# EAGLE design fisk-batt-6 (EAGLE 7.6.0)
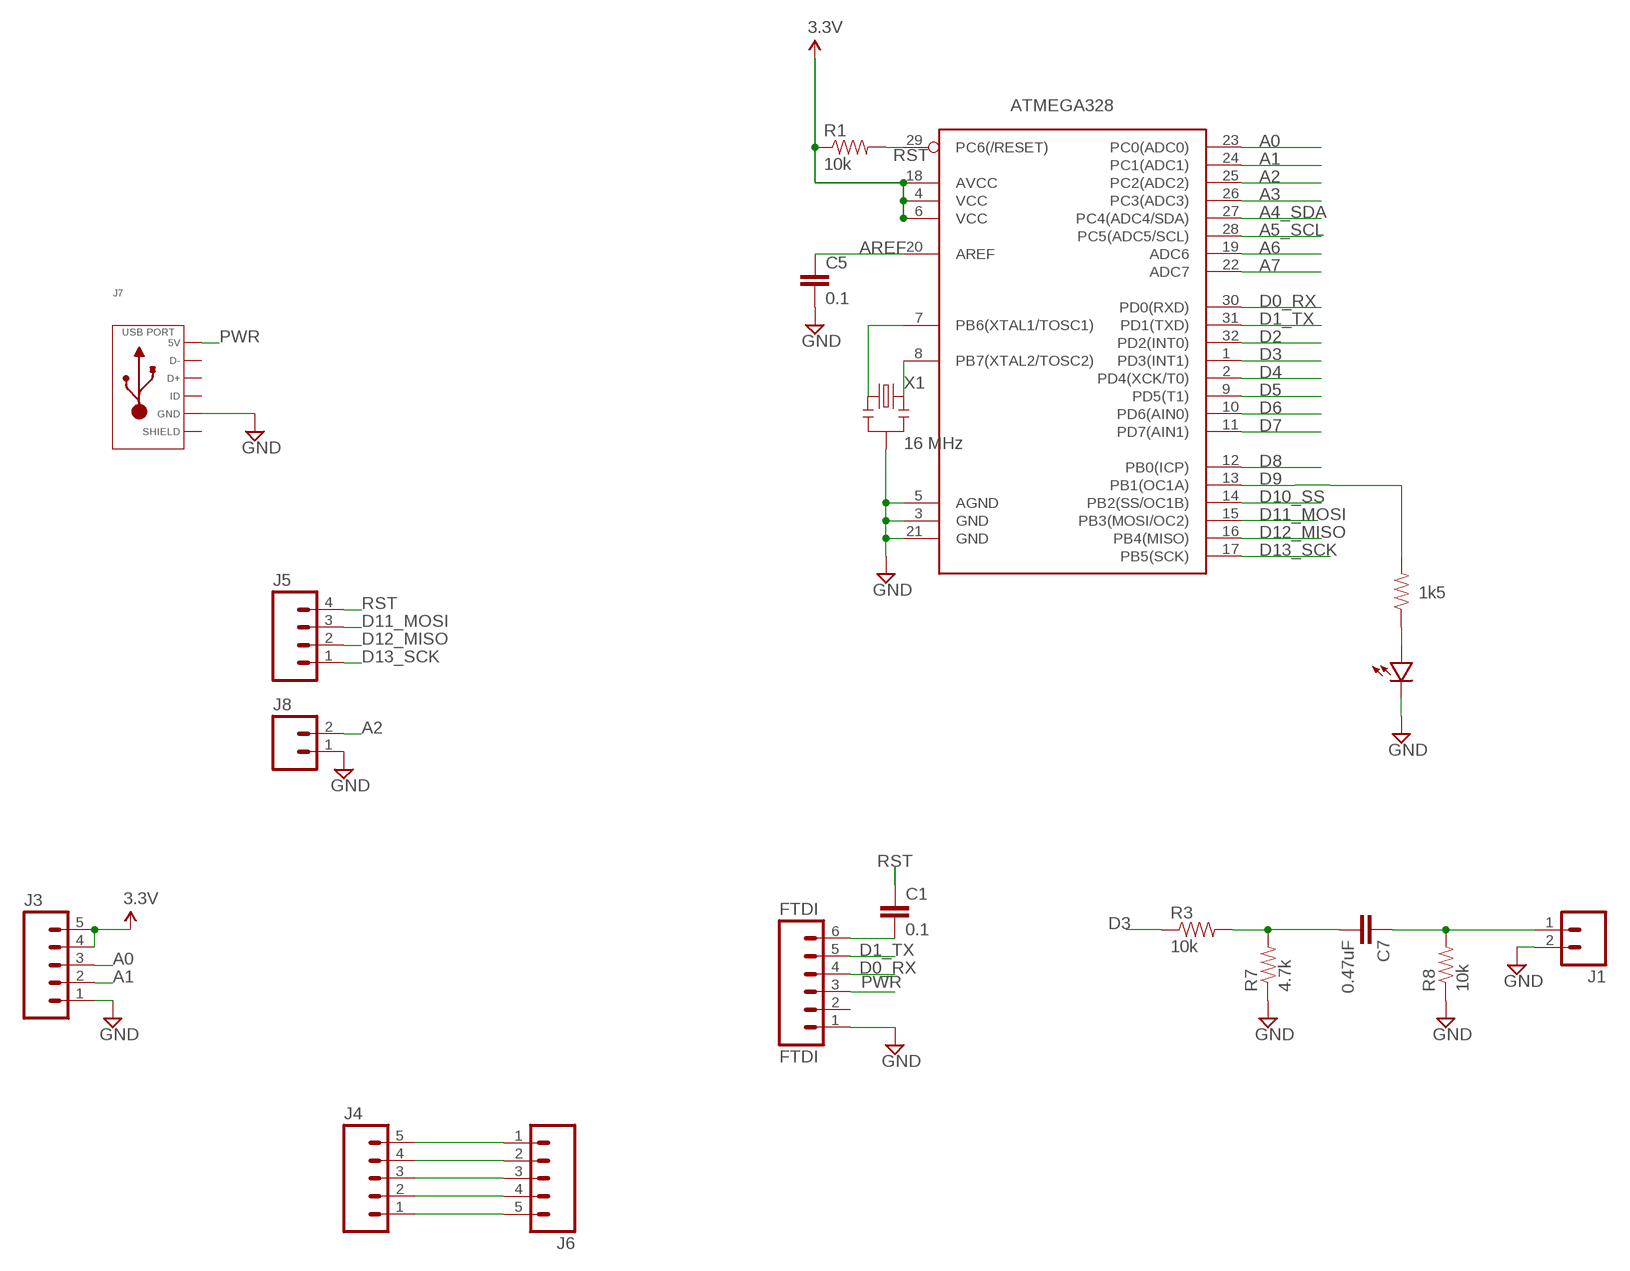
[diagram p0: schematic, sheet 1, part 1 of 2]
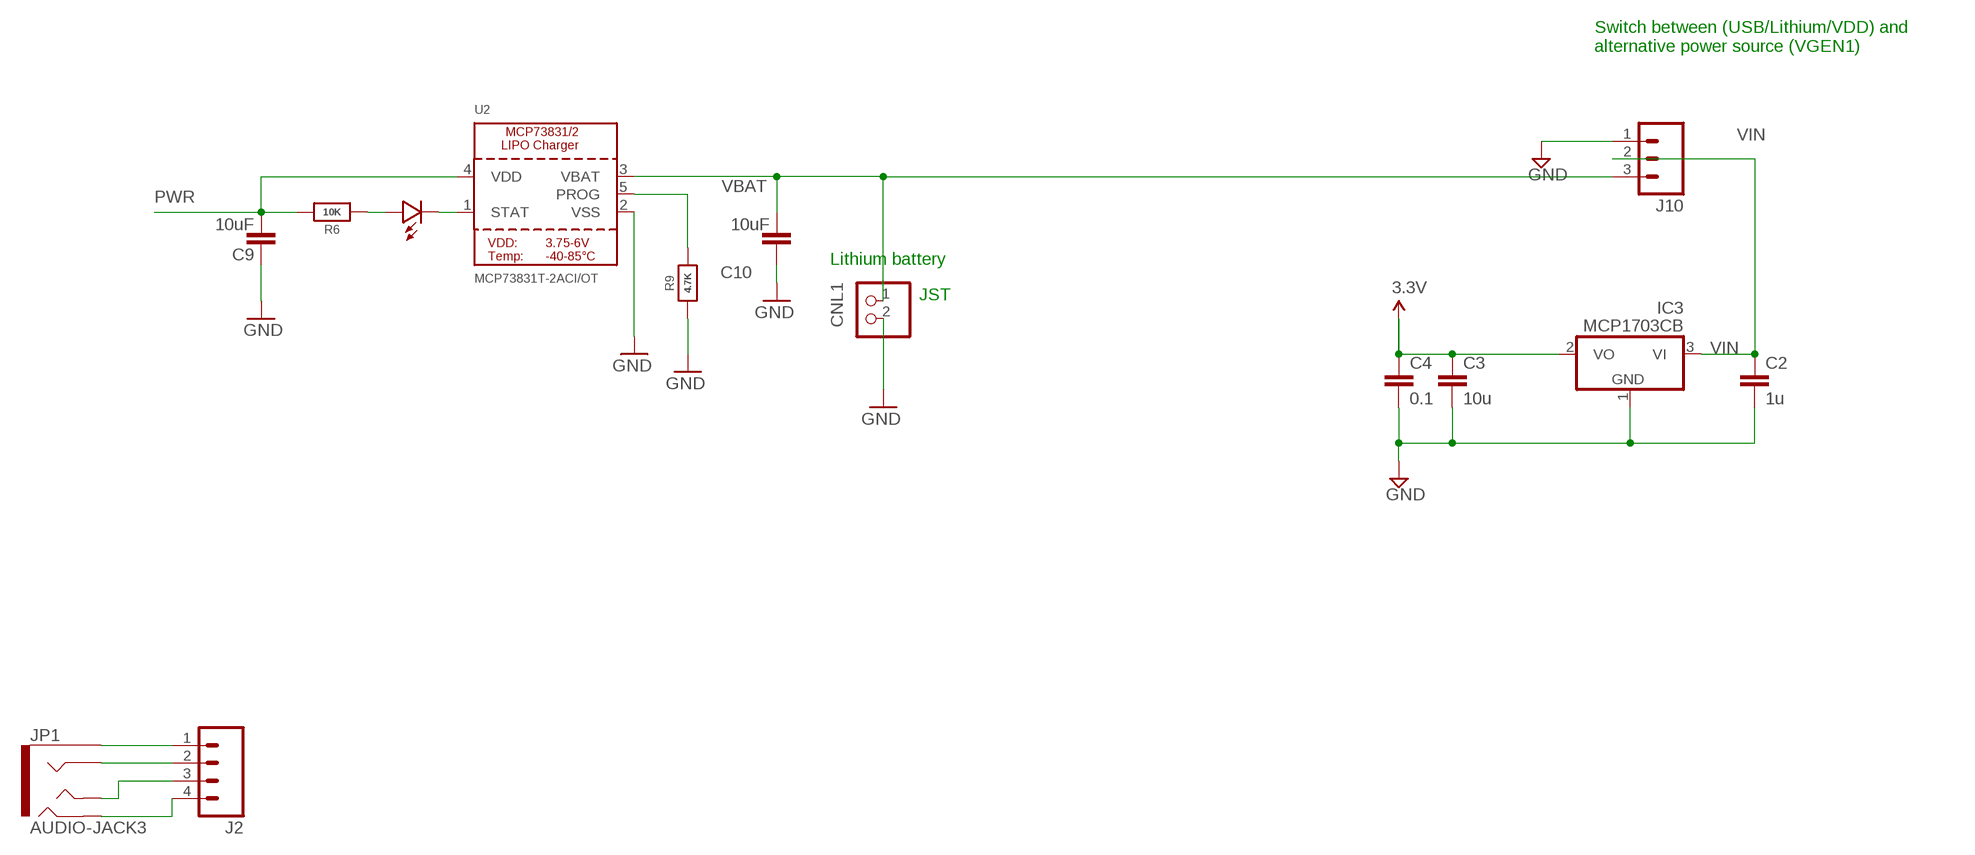
[diagram p1: schematic, sheet 1, part 2 of 2]

## Parts
ATMEGA328  ATMega-328  ATMEGA168/328TQFP32  [TQFP32-08]
C1  0.1  CAP0603-CAP  [0603-CAP]
C2  1u  CAP0603-CAP  [0603-CAP]
C3  10u  CAP0805-CAP  [0805-CAP]
C4  0.1  CAP0603-CAP  [0603-CAP]
C5  0.1  CAP0603-CAP  [0603-CAP]
C7  0.47uF  CAP0603-CAP  [0603-CAP]
C9  10uF  CAP0603-CAP  [0603-CAP]
C10  10uF  CAP0603-CAP  [0603-CAP]
CNL1  JST_2PIN-SMT-RA  [JST-PH-2-SMT-RA]
D2  LED0603  [0603-LED]
FTDI  FTDI  M06SIP  [1X06]
IC3  MCP1703CB  [SOT23]
J1  M02PTH  [1X02]
J2  M04PTH  [1X04]
J3  M05PTH  [1X05]
J4  M05PTH  [1X05]
J5  M04PTH  [1X04]
J6  M05SCREW  [SCREWTERMINAL-3.5MM-5]
J7  USB_MICRO_RIGHT  [MICROUSB-RIGHT]
J8  M02PTH  [1X02]
J10  M03PTH  [1X03]
JP1  AUDIO-JACK3  [AUDIO-JACK-TRRS-SMD]
R1  10k  RESISTOR0603-RES  [0603-RES]
R2  1k5  RESISTOR0603-RES  [0603-RES]
R3  10k  RESISTOR0603-RES  [0603-RES]
R6  10K  RESISTOR_0603_NOOUT  [0603-NO]
R7  4.7k  RESISTOR0603-RES  [0603-RES]
R8  10k  RESISTOR0603-RES  [0603-RES]
R9  4.7K  RESISTOR_0603_NOOUT  [0603-NO]
U2  MCP73831T-2ACI/OT  MCP73831/2  [SOT23-5]
U$2  LED0603  [0603-LED]
X1  16 MHz  RESONATORSMD  [RESONATOR-SMD]

## Nets
A0: ATMEGA328.23(PC0(ADC0)) J3.3
A1: ATMEGA328.24(PC1(ADC1)) J3.2
A2: ATMEGA328.25(PC2(ADC2)) J8.2
A3: ATMEGA328.26(PC3(ADC3))
A4_SDA: ATMEGA328.27(PC4(ADC4/SDA))
A5_SCL: ATMEGA328.28(PC5(ADC5/SCL))
A6: ATMEGA328.19(ADC6)
A7: ATMEGA328.22(ADC7)
AREF: ATMEGA328.20(AREF) C5.1
D0_RX: ATMEGA328.30(PD0(RXD)) FTDI.4
D1_TX: ATMEGA328.31(PD1(TXD)) FTDI.5
D2: ATMEGA328.32(PD2(INT0))
D3: ATMEGA328.1(PD3(INT1)) R3.1
D4: ATMEGA328.2(PD4(XCK/T0))
D5: ATMEGA328.9(PD5(T1))
D6: ATMEGA328.10(PD6(AIN0))
D7: ATMEGA328.11(PD7(AIN1))
D8: ATMEGA328.12(PB0(ICP))
D9: ATMEGA328.13(PB1(OC1A)) R2.2
D10_SS: ATMEGA328.14(PB2(SS/OC1B))
D11_MOSI: ATMEGA328.15(PB3(MOSI/OC2)) J5.3
D12_MISO: ATMEGA328.16(PB4(MISO)) J5.2
D13_SCK: ATMEGA328.17(PB5(SCK)) J5.1
GND [power]: ATMEGA328.3(GND) ATMEGA328.5(AGND) ATMEGA328.21(GND) C2.2 C3.2 C4.2 C5.2 C9.2 C10.2 CNL1.2 FTDI.1 IC3.1(GND) J1.2 J3.1 J7.5(GND) J8.1 J10.1 R7.1 R8.1 R9.1 U2.2(VSS) U$2.MINUS X1.2
N$1: ATMEGA328.7(PB6(XTAL1/TOSC1)) X1.1
N$2: R2.1 U$2.PLUS
N$3: C7.2 R3.2 R7.2
N$4: C7.1 J1.1 R8.2
N$5: J2.1 JP1.EARTH
N$6: J2.2 JP1.RING1
N$7: J2.3 JP1.TIP
N$8: J2.4 JP1.RING2
N$9: J4.5 J6.1
N$10: J4.4 J6.2
N$11: J4.3 J6.3
N$12: J4.2 J6.4
N$13: J4.1 J6.5
N$16: R9.2 U2.5(PROG)
N$17: D2.MINUS U2.1(STAT)
N$18: D2.PLUS R6.1
N$20: C1.2 FTDI.6
N$21: ATMEGA328.8(PB7(XTAL2/TOSC2)) X1.3
PWR [power]: C9.1 FTDI.3 J7.1(5V) R6.2 U2.4(VDD)
RST: ATMEGA328.29(PC6(/RESET)) C1.1 J5.4 R1.2
VBAT [power]: C10.1 CNL1.1 J10.3 U2.3(VBAT)
VCC: ATMEGA328.4(VCC) ATMEGA328.6(VCC) ATMEGA328.18(AVCC) C3.1 C4.1 IC3.2(VO) J3.4 J3.5 R1.1 ; supply symbol labelled 3.3V
VIN: C2.1 IC3.3(VI) J10.2
Unconnected: FTDI.2 J7.2(D-) J7.3(D+) J7.4(ID)

## Notes on the sheet
- Switch between (USB/Lithium/VDD) and 
  alternative power source (VGEN1)
- Lithium battery
- JST

## Power pins joined to a net without a drawn wire
SLD: J7.S1(SLD) J7.S2(SLD) J7.S3(SLD) J7.S4(SLD) J7.S5(SLD) J7.S6(SLD) J7.S7(SLD) J7.S8(SLD)

## Library data of the parts
ATMEGA328 = LowPowerLab:ATMEGA168/328: Atmel 32-pin 8-bit micro, 16k flash.
C1-C5 C7 = LowPowerLab:CAP: Capacitor Standard 0603 ceramic capacitor, and 0.1" leaded capacitor.
C9 C10 = SparkFun:CAP: Capacitor Standard 0603 ceramic capacitor, and 0.1" leaded capacitor.
CNL1 = adafruit:JST_2PIN: JST 2-Pin Connectors of various flavors SMT-RA (S2B-PH-SM4) 4UConnector #17311 SMT (B2B-PH-SM4) THM-RA (S2B-PH) THM (B2B-PH)
D2 U$2 = LowPowerLab:LED
FTDI = SparkFun-Connectors:M06: Header 6 Standard 6-pin 0.1" header. Use with straight break away headers (SKU : PRT-00116), right angle break away headers (PRT-00553), swiss pins (PRT-00743), machine pins (PRT-00117), and female headers (PRT-00115). Molex polarized connector foot print use with SKU : PRT-08094 with associated crimp pins and housings. NOTES ON THE VARIANTS LOCK and LOCK_LONGPADS... This footprint was designed to help hold the alignment of a through-hole component (i.e. 6-pin header) while soldering it into place. You may notice that each hole has been shifted either up or down by 0.005 of an inch from it's more standard position (which is a perfectly straight line). This slight alteration caused the pins (the squares in the middle) to touch the edges of the holes. Because they are alternating, it causes a "brace" to hold the component in place. 0.005 has proven to be the perfect amount of "off-center" position when using our standard breakaway headers. Although looks a little odd when you look at the bare footprint, once you have a header in there, the alteration is very hard to notice. Also, if you push a header all the way into place, it is covered up entirely on the bottom side. This idea of altering the position of holes to aid alignment will be further integrated into the Sparkfun Library for other footprints. It can help hold any component with 3 or more connection pins.
IC3 = linear:MCP1703: 250 mA, 16V, Low Quiescent Current LDO Regulator Source: http://ww1.microchip.com/downloads/en/DeviceDoc/22049b.pdf
J1 J8 = SparkFun-Connectors:M02: Standard 2-pin 0.1" header. Use with - straight break away headers ( PRT-00116) - right angle break away headers (PRT-00553) - swiss pins (PRT-00743) - machine pins (PRT-00117) - female headers (PRT-00115) Molex polarized connector foot print use with: PRT-08233 with associated crimp pins and housings. 2.54_SCREWTERM for use with PRT-10571. 3.5mm Screw Terminal footprints for PRT-08084 5mm Screw Terminal footprints for use with PRT-08432
J2 J5 = SparkFun-Connectors:M04: Header 4 Standard 4-pin 0.1" header. Use with straight break away headers (SKU : PRT-00116), right angle break away headers (PRT-00553), swiss pins (PRT-00743), machine pins (PRT-00117), and female headers (PRT-00115). Molex polarized connector foot print use with SKU : PRT-08231 with associated crimp pins and housings. 1MM SMD Version SKU: PRT-10208; PROD_ID: CONN-09696
J3 J4 = SparkFun-Connectors:M05: Header 5 Standard 5-pin 0.1" header. Use with straight break away headers (SKU : PRT-00116), right angle break away headers (PRT-00553), swiss pins (PRT-00743), machine pins (PRT-00117), and female headers (PRT-00115). Molex polarized connector foot print use with SKU : PRT-08230 with associated crimp pins and housings.
J6 = SparkFun-Connectors:M05: Header 5 Standard 5-pin 0.1" header. Use with straight break away headers (SKU : PRT-00116), right angle break away headers (PRT-00553), swiss pins (PRT-00743), machine pins (PRT-00117), and female headers (PRT-00115). Molex polarized connector foot print use with SKU : PRT-08230 with associated crimp pins and housings.; PROD_ID: Combine 8288+8399
J7 = MF_Connectors:USB: Library: MF_Connectors Description: 5 Pin USB Connectors. SLD is the shield connection. Usually tied to ground through a small ferrite bead.
J10 = SparkFun-Connectors:M03: Header 3 Standard 3-pin 0.1" header. Use with straight break away headers (SKU : PRT-00116), right angle break away headers (PRT-00553), swiss pins (PRT-00743), machine pins (PRT-00117), and female headers (PRT-00115). Molex polarized connector foot print use with SKU : PRT-08232 with associated crimp pins and housings.
JP1 = SparkFun-Connectors:AUDIO-JACK3: Audio jack - 3.5mm TRRS variety - two rings.
R1-R3 R7 R8 = LowPowerLab:RESISTOR: Resistor Basic schematic elements and footprints for 0603, 1206, and PTH resistors.
R6 R9 = microbuilder:RESISTOR: Resistors For new designs, use the packages preceded by an '_' character since they are more reliable: The following footprints should be used on most boards: _0402 - Standard footprint for regular board layouts _0603 - Standard footprint for regular board layouts _0805 - Standard footprint for regular board layouts _1206 - Standard footprint for regular board layouts For extremely tight-pitch boards where space is at a premium, the following 'micro-pitch' footprints can be used (smaller pads, no silkscreen outline, etc.): _0402MP - Micro-pitch footprint for very dense/compact boards _0603MP - Micro-pitch footprint for very dense/compact boards _0805MP - Micro-pitch footprint for very dense/compact boards _1206MP - Micro-pitch footprint for very dense/compact boards
U2 = microbuilder:MCP73831/2: MCP73831/2 LIPO Charger VDD: 3.75 - 6V Temp -40 - 85°C Programmable Charge Rate: 15-500mA NOTE: STAT is a tri-state logic output on the MCP73831 and an open-drain output on the MCP73832. SOT23-5 with 4.2V output and tri-state logic on STAT = MCP73831T-2ACI/OT
X1 = SparkFun:RESONATOR: Resonator Small SMD resonator. This is the itty bitty 10/20MHz resonators with built in caps. CSTCE10M0G55 and CSTCE20M0V53. Footprint has been reviewed closely but hasn't been tested yet.

## Net classes
1 power: width 0.305 mm

## Board
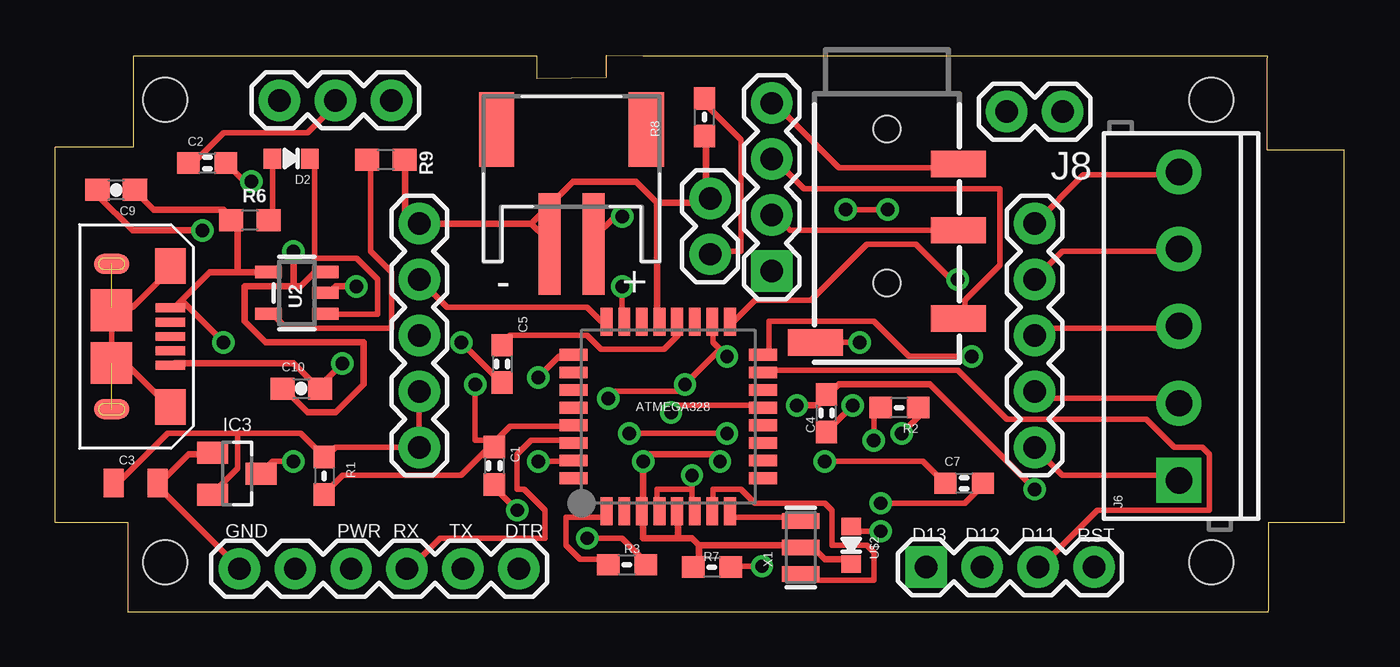
[diagram p2: board, top side]
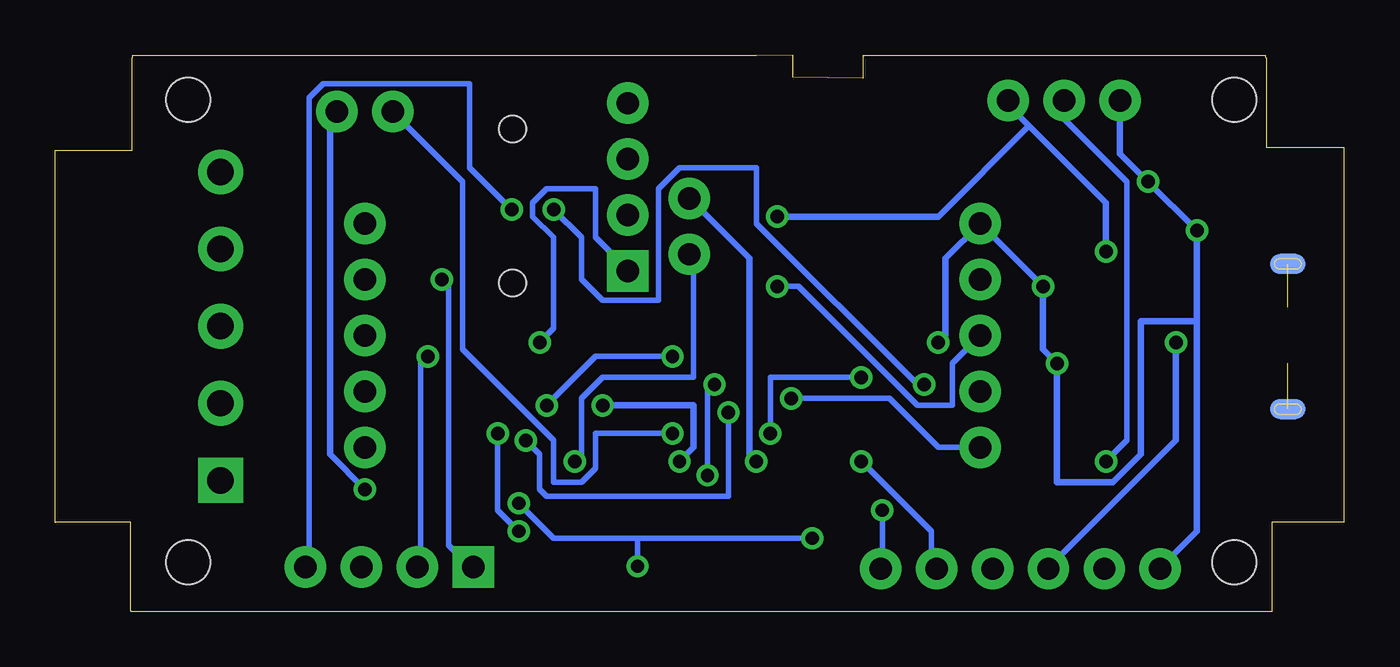
[diagram p3: board, bottom side, seen from below]

Size 58.55 x 25.28 mm. Coordinates in mm from the lower left corner, seen from the top.
Outline: 3.3,0 3.3,4.06 0,4.06 0,21.08 3.56,21.08 3.56,25.15
Outline: 55.12,0.05 55.12,4.06 58.55,4.06
Outline: 58.55,4.06 58.55,4.05
Outline: 3.3,0 55.1,0 55.1,0.05
Outline: 58.55,4.06 58.55,20.95 55.05,20.95 55.05,25.15
Outline: 3.56,25.15 3.56,25.25 21.88,25.25 21.88,24.23 25.05,24.26 25.05,25.28 26.7,25.25 55.05,25.25 55.05,25.15
Copper layers (1*16): Top 0.035mm / dielectric 1.5mm / Bottom 0.035mm
Design rules "default": minimum track width 10mil, minimum drill 24mil, track to track 8mil, track to pad 8mil, pad to pad 8mil, via to via 8mil, smd to smd 8mil, copper to edge 40mil, drill to drill 8mil, minimum pad ring 10mil, minimum via ring 8mil, stop-mask expansion 4mil, vias tented up to drill 0mil, thermal gap 10mil
Holes 2 mm at 5,2.25 5,23.25 52.5,2.25 52.5,23.25

### Footprints (pad centres in the part's own frame; a part is rotated, then mirrored left to right if it is on the bottom)
TQFP32-08 = smd 1.27 x 0.533: 1 -4.293,2.8; 2 -4.293,2; 3 -4.293,1.2; 4 -4.293,0.4; 5 -4.293,-0.4; 6 -4.293,-1.2; 7 -4.293,-2; 8 -4.293,-2.8; 17 4.293,-2.8; 18 4.293,-2; 19 4.293,-1.2; 20 4.293,-0.4; 21 4.293,0.4; 22 4.293,1.2; 23 4.293,2; 24 4.293,2.8 | smd 0.533 x 1.27: 9 -2.8,-4.293; 10 -2,-4.293; 11 -1.2,-4.293; 12 -0.4,-4.293; 13 0.4,-4.293; 14 1.2,-4.293; 15 2,-4.293; 16 2.8,-4.293; 25 2.8,4.293; 26 2,4.293; 27 1.2,4.293; 28 0.4,4.293; 29 -0.4,4.293; 30 -1.2,4.293; 31 -2,4.293; 32 -2.8,4.293
0603-CAP = smd 1.016 x 0.965: 1 -0.85,0; 2 0.85,0
0805-CAP = smd 0.902 x 1.3: 1 -1,0; 2 1,0
0603-CAP' = smd 1.1 x 1: 1 -0.85,0; 2 0.85,0
JST-PH-2-SMT-RA = smd 1 x 4.6: 1 1,-3.7; 2 -1,-3.7 | smd 1.6 x 3.4: NC1 -3.4,1.5; NC2 3.4,1.5
0603-LED = smd 0.8 x 0.9: MINUS -0.85,0; PLUS 0.85,0
1X06 = drill 1.016 pad 1.88: 1 0,0; 2 2.54,0; 3 5.08,0; 4 7.62,0; 5 10.16,0; 6 12.7,0
SOT23 = smd 1 x 1.4: 1 -0.95,-1.1; 2 0.95,-1.1; 3 0,1.1
1X02 = drill 1.016 pad 1.88: 1 0,0; 2 2.54,0
1X04 = drill 1.016 pad 1.88 square: 1 0,0 | drill 1.016 pad 1.88: 2 2.54,0; 3 5.08,0; 4 7.62,0
1X05 = drill 1.016 pad 1.88: 1 0,0; 2 2.54,0; 3 5.08,0; 4 7.62,0; 5 10.16,0
SCREWTERMINAL-3.5MM-5 = drill 1.2 pad 2.032 square: 1 0,0 | drill 1.2 pad 2.032: 2 3.5,0; 3 7,0; 4 10.5,0; 5 14,0
MICROUSB-RIGHT = smd 0.4 x 1.35: 1 -1.3,1.27; 2 -0.65,1.27; 3 0,1.27; 4 0.65,1.27; 5 1.3,1.27 | smd 0.9 x 1.6: S1 -3.3,-1.4; S2 3.3,-1.4 | smd 1.6 x 1.4: S3 -3.2,1.27; S4 3.2,1.27 | smd 1.9 x 1.9: S5 -1.2,-1.405; S6 1.2,-1.405 | smd 0.9 x 1.6 bottom: S7 -3.3,-1.4; S8 3.3,-1.4
1X03 = drill 1.016 pad 1.88: 1 0,0; 2 2.54,0; 3 5.08,0
AUDIO-JACK-TRRS-SMD = smd 1.2 x 2.5: EARTH 11.3,-3.25; RING1 6.2,3.25; RING2 3.2,3.25; TIP 10.2,3.25 | hole 1.2: 1.6,0; 8.6,0
0603-RES = smd 1.016 x 0.965: 1 -0.85,0; 2 0.85,0
0603-NO = smd 1.1 x 1: 1 -0.85,0; 2 0.85,0
SOT23-5 = smd 0.55 x 1.2: 1 -0.95,-1.3; 2 0,-1.3; 3 0.95,-1.3; 4 0.95,1.3; 5 -0.95,1.3
RESONATOR-SMD = smd 0.7 x 1.7: 1 -1.2,0; 2 0,0; 3 1.2,0

### Placement (x,y rotation side)
ATMEGA328  27.84,8.87 90 top
C1  19.95,6.63 270 top
C2  6.92,20.37 0 top
C3  3.66,5.84 0 top
C4  35.03,9.02 90 top
C5  20.3,11.25 270 top
C7  41.28,5.84 0 top
C9  10uF  [0603-CAP']  2.77,19.15 180 top
C10  10uF  [0603-CAP']  11.18,10.14 0 top
CNL1  23.45,20.4 0 top
D2  10.73,20.58 180 top
FTDI  8.36,1.96 0 top
IC3  8.26,6.28 270 top
J1  29.75,16.23 90 top
J2  32.54,15.47 90 top
J3  16.54,17.63 270 top
J4  44.48,17.63 270 top
J5  39.55,2.03 0 top
J6  51.03,5.97 90 top
J7  3.97,12.5 270 top
J8  45.75,22.71 180 top
J10  10.19,23.22 0 top
JP1  37.78,23.52 270 top
R1  12.22,6.17 270 top
R2  38.33,9.27 180 top
R3  25.97,2.14 0 top
R6  8.85,17.78 180 top
R7  29.83,2.03 0 top
R8  29.5,22.46 90 top
R9  15.02,20.53 180 top
U2  10.98,14.48 90 top
U$2  36.15,3.02 90 top
X1  33.86,2.92 90 top

### Tracks (layer width: path | path; a pad name or v marks a point on that pad's centre or on a via)
A0  (via drill 0.61)
  Top 0.254: v25.75,14.77 25.75,13.19 ATMEGA328.23
  Bottom 0.254: v25.75,14.77 24.8,14.77 19.4,9.38 17.81,9.38 17.81,11.28 J3.3
A1
  Top 0.254: J3.2 17.81,13.82 24.16,13.82 24.8,13.19 ATMEGA328.24
A2  (via drill 0.61)
  Top 0.254: v21.94,10.64 22.89,11.6 23.53,11.6 ATMEGA328.25 | v30.51,8.11 v26.07,8.11
  Bottom 0.254: v21.94,10.64 26.07,10.64 v26.07,8.11 | v30.51,8.11 34,8.11 34,6.52 34.64,5.88 35.91,5.88 35.91,7.79 40.04,11.91 40.04,19.54 J8.2
AREF
  Top 0.254: C5.1 20.35,12.23 20.67,12.55 24.16,12.55 24.8,11.91 27.65,11.91 28.29,12.55 28.29,12.87 ATMEGA328.20
D0_RX
  Top 0.254: ATMEGA328.30 23.53,7.79 21.62,7.79 20.99,7.15 20.99,5.56 21.3,5.56 22.26,4.61 22.26,3.34 17.49,3.34 16.22,2.07 FTDI.4
D1_TX  (via drill 0.61)
  Top 0.254: v21.94,6.83 23.53,6.83 ATMEGA328.31
  Bottom 0.254: v21.94,6.83 18.76,3.66 18.76,2.07 FTDI.5
D3
  Top 0.254: R3.1 25.11,2.39 23.84,2.39 23.21,3.02 23.21,4.29 24.8,4.29 ATMEGA328.1
D9  (via drill 0.61)
  Top 0.254: v37.18,7.79 37.18,9.06 R2.2 | v27.97,9.06 28.29,9.38 32.1,9.38 ATMEGA328.13
  Bottom 0.254: v37.18,7.79 36.54,7.15 36.54,5.56 36.23,5.25 27.97,5.25 v27.97,9.06
D11_MOSI
  Top 0.254: ATMEGA328.15 32.42,10.96 40.99,10.96 43.21,8.74 49.56,8.74 50.83,7.47 52.1,7.47 52.42,7.15 52.42,4.61 47.34,4.61 44.8,2.07 J5.3
D12_MISO  (via drill 0.61)
  Top 0.254: v41.62,11.6 38.77,11.6 37.18,13.19 32.42,13.19 32.42,11.91 ATMEGA328.16
  Bottom 0.254: v41.62,11.6 41.94,11.28 41.94,2.07 J5.2
D13_SCK  (via drill 0.61)
  Top 0.254: v40.99,15.09 40.67,15.09 39.08,16.68 36.86,16.68 34.32,14.14 31.78,14.14 30.83,13.19 ATMEGA328.17
  Bottom 0.254: v40.99,15.09 40.67,14.77 40.67,3.02 39.72,2.07 J5.1
GND  (via drill 0.61)
  Top 0.305: IC3.1 7.02,7.15 6.06,7.15 4.79,5.88 C3.2 4.79,5.56 8.29,2.07 FTDI.1 | v8.92,19.54 8.6,19.54 7.97,20.17 C2.2 | v6.7,17.31 3.52,17.31 1.94,18.9 C9.2 | v44.48,5.56 39.72,10.33 35.59,10.33 35.27,10.01 C4.2 34.96,9.69 34.64,9.38 v33.69,9.38 | U$2.MINUS 35.91,2.39 34.96,2.39 34.64,2.71 34,2.71 X1.2 33.69,3.02 29.24,3.02 | 29.24,3.02 29.24,2.07 R7.1 | 28.29,3.34 28.92,3.34 29.24,3.02 | 28.29,3.34 26.7,3.34 26.7,4.29 ATMEGA328.3 26.7,4.61 v26.7,6.83 27.02,7.15 29.88,7.15 v30.19,6.83 | 28.29,3.34 28.29,4.29 ATMEGA328.5 | R8.1 29.56,21.44 29.56,18.9 J1.2 29.56,18.58 27.34,18.58 | 27.34,18.58 27.34,13.19 ATMEGA328.21 | J7.5 5.43,11.28 10.83,11.28 11.78,10.33 C10.2 12.1,10.33 v13.05,11.28 | v18.45,12.23 20.03,10.64 C5.2 | R9.1 15.91,20.49 15.91,17.63 J3.1 21.62,17.63 | v13.68,14.77 12.73,14.77 12.41,14.46 U2.2 | 21.62,17.63 22.26,17 CNL1.2 | 27.34,18.58 26.38,19.54 23.53,19.54 21.62,17.63
  Bottom 0.305: J10.1 10.19,20.8 v8.92,19.54 v6.7,17.31 6.7,13.19 | 6.7,13.19 6.7,3.66 8.29,2.07 FTDI.1 | v44.48,5.56 46.07,7.15 46.07,22.39 J8.1 | v26.7,6.83 27.02,7.15 27.02,16.04 J1.2 | v18.45,12.23 18.13,12.55 18.13,16.04 J3.1 v13.68,14.77 13.68,11.91 v13.05,11.28 13.05,5.88 10.51,5.88 9.24,7.15 9.24,13.19 6.7,13.19 | v33.69,9.38 29.56,9.38 29.56,7.47 v30.19,6.83
N$1
  Top 0.254: ATMEGA328.7 29.88,4.61 29.88,5.56 31.15,5.56 31.78,4.93 34.96,4.93 35.27,4.61 35.27,3.02 36.86,3.02 37.18,2.71 37.18,1.44 34,1.44 X1.1
N$2  (via drill 0.61)
  Top 0.254: v37.5,3.66 36.23,3.66 U$2.PLUS | v38.45,8.11 39.4,9.06 R2.1
  Bottom 0.254: v37.5,3.66 38.45,4.61 v38.45,8.11
N$3  (via drill 0.61)
  Top 0.254: v24.16,3.34 25.75,3.34 26.7,2.39 R3.2 | v32.1,2.07 30.83,2.07 R7.2 | v37.5,4.93 41.31,4.93 41.94,5.56 C7.2
  Bottom 0.254: 32.1,3.34 v24.16,3.34 | v32.1,2.07 32.1,3.34 | v37.5,4.93 35.91,3.34 32.1,3.34
N$4  (via drill 0.61)
  Top 0.254: R8.2 29.56,23.03 31.15,21.44 31.15,16.36 29.88,16.36 J1.1 | v34.96,6.83 39.4,6.83 40.35,5.88 C7.1
  Bottom 0.254: v34.96,6.83 34.64,7.15 34.64,9.69 33.69,10.64 29.56,10.64 29.56,16.04 J1.1
N$5  (via drill 0.61)
  Top 0.254: v36.54,12.23 34.64,12.23 JP1.EARTH
  Bottom 0.254: v36.54,12.23 35.91,12.87 35.91,17 36.86,17.95 36.86,18.58 36.23,19.22 34,19.22 34,17 32.73,15.72 J2.1
N$6
  Top 0.254: JP1.RING1 40.99,17.31 33.37,17.31 32.73,17.95 J2.2
N$7
  Top 0.254: JP1.TIP 41.31,13.5 41.31,14.14 42.89,15.72 42.89,19.22 34,19.22 32.73,20.49 J2.3
N$8
  Top 0.254: JP1.RING2 40.99,20.17 35.59,20.17 32.73,23.03 J2.4
N$9
  Top 0.254: J4.5 45.75,6.2 50.83,6.2 J6.1
N$10
  Top 0.254: J4.4 44.8,9.69 50.83,9.69 J6.2
N$11
  Top 0.254: J4.3 44.8,12.87 50.83,12.87 J6.3
N$12
  Top 0.254: J4.2 45.75,16.36 50.83,16.36 J6.4
N$13
  Top 0.254: J4.1 46.7,19.85 50.83,19.85 J6.5
N$16
  Top 0.254: R9.2 14.32,20.49 14.32,16.36 15.27,15.41 15.27,12.87 10.51,12.87 9.87,13.5 U2.5
N$17
  Top 0.254: D2.MINUS 11.78,20.49 11.78,16.04 13.68,16.04 14.64,15.09 14.64,13.5 12.41,13.5 U2.1
N$18
  Top 0.254: D2.PLUS 9.87,20.49 9.87,17.95 R6.1
N$20  (via drill 0.61)
  Top 0.254: v20.99,4.61 20.03,5.56 C1.2
  Bottom 0.254: v20.99,4.61 20.99,2.07 FTDI.6
N$21
  Top 0.254: ATMEGA328.8 30.83,4.29 33.69,4.29 X1.3
PWR  (via drill 0.61)
  Top 0.305: 8.29,15.41 8.29,17.63 R6.2 7.97,17.95 7.65,18.27 4.48,18.27 3.84,18.9 C9.1 | 8.29,15.41 9.56,15.41 U2.4 | 5.75,14.14 7.02,15.41 8.29,15.41 | 5.75,14.14 5.43,13.82 J7.1 | 5.75,14.14 v7.65,12.23
  Bottom 0.305: v7.65,12.23 7.65,7.79 13.37,2.07 FTDI.3
RST  (via drill 0.61)
  Top 0.254: R1.2 12.41,5.56 13.05,6.2 18.45,6.2 19.72,7.47 C1.1 | ATMEGA328.29 23.53,8.42 20.67,8.42 20.03,7.79 C1.1 | v35.91,18.27 v37.81,18.27 | v19.08,10.33 19.08,7.79 19.72,7.79 C1.1
  Bottom 0.254: v37.81,18.27 39.72,20.17 39.72,23.98 46.39,23.98 47.02,23.35 47.02,2.07 J5.4 | v35.91,18.27 34.64,17 34.64,15.09 33.69,14.14 31.15,14.14 31.15,19.22 30.19,20.17 26.7,20.17 26.7,17.63 19.4,10.33 v19.08,10.33
SLD  (4 unrouted)
  Top 0.254: J7.S4 5.11,9.38 3.21,11.28 2.57,11.28 J7.S6 2.57,11.6 2.57,13.5 J7.S5 2.57,13.82 3.52,13.82 5.11,15.41 J7.S3
VBAT  (via drill 0.61)
  Top 0.305: 10.83,14.77 11.14,14.77 11.78,15.41 12.1,15.41 U2.3 | 10.83,14.77 8.6,14.77 8.6,13.19 9.56,12.23 14,12.23 14,10.33 12.73,9.06 11.46,9.06 10.51,10.01 C10.1 | 10.83,14.77 v10.83,16.36 | v25.75,17.95 25.43,17.95 24.48,17 CNL1.1
  Bottom 0.305: 14.32,22.08 10.83,18.58 v10.83,16.36 | 14.32,22.08 15.27,23.03 J10.3 | v25.75,17.95 18.45,17.95 14.32,22.08
VCC  (via drill 0.61)
  Top 0.254: 28.92,5.56 27.34,5.56 27.34,4.61 ATMEGA328.4 | 28.92,5.56 28.92,4.61 ATMEGA328.6 | v36.23,9.38 35.27,8.42 C4.1 | 30.19,11.91 29.88,12.23 29.88,12.87 ATMEGA328.18 | v28.92,6.2 28.92,5.56 | 30.19,11.91 v28.61,10.33 28.29,10.01 25.43,10.01 v25.11,9.69 | 30.19,11.91 v30.51,11.6 | 8.29,8.11 11.14,8.11 12.1,7.15 R1.1 12.41,7.15 12.73,7.47 J3.5 J3.4 | 8.29,8.11 5.11,8.11 2.89,5.88 C3.1 | 8.29,8.11 8.29,6.52 7.33,5.56 IC3.2
  Bottom 0.254: v36.23,9.38 34,11.6 v30.51,11.6 | v28.92,6.2 28.92,10.01 v28.61,10.33 | v25.11,9.69 20.67,9.69 18.45,7.47 J3.5
VIN  (via drill 0.61)
  Top 0.254: C2.1 6.38,20.49 7.65,21.76 11.46,21.76 12.73,23.03 J10.2 | v10.83,6.83 9.87,6.83 9.56,6.52 IC3.3
  Bottom 0.254: v10.83,6.83 9.87,7.79 9.87,19.54 12.73,22.39 J10.2

### Text on the board
tPlace: GND | PWR | RX | TX | DTR | RST | D13 | D12 | D11